# Altium schematic sheet MCU(ZC-ST4X-A005A)(1).SchDoc
size A1
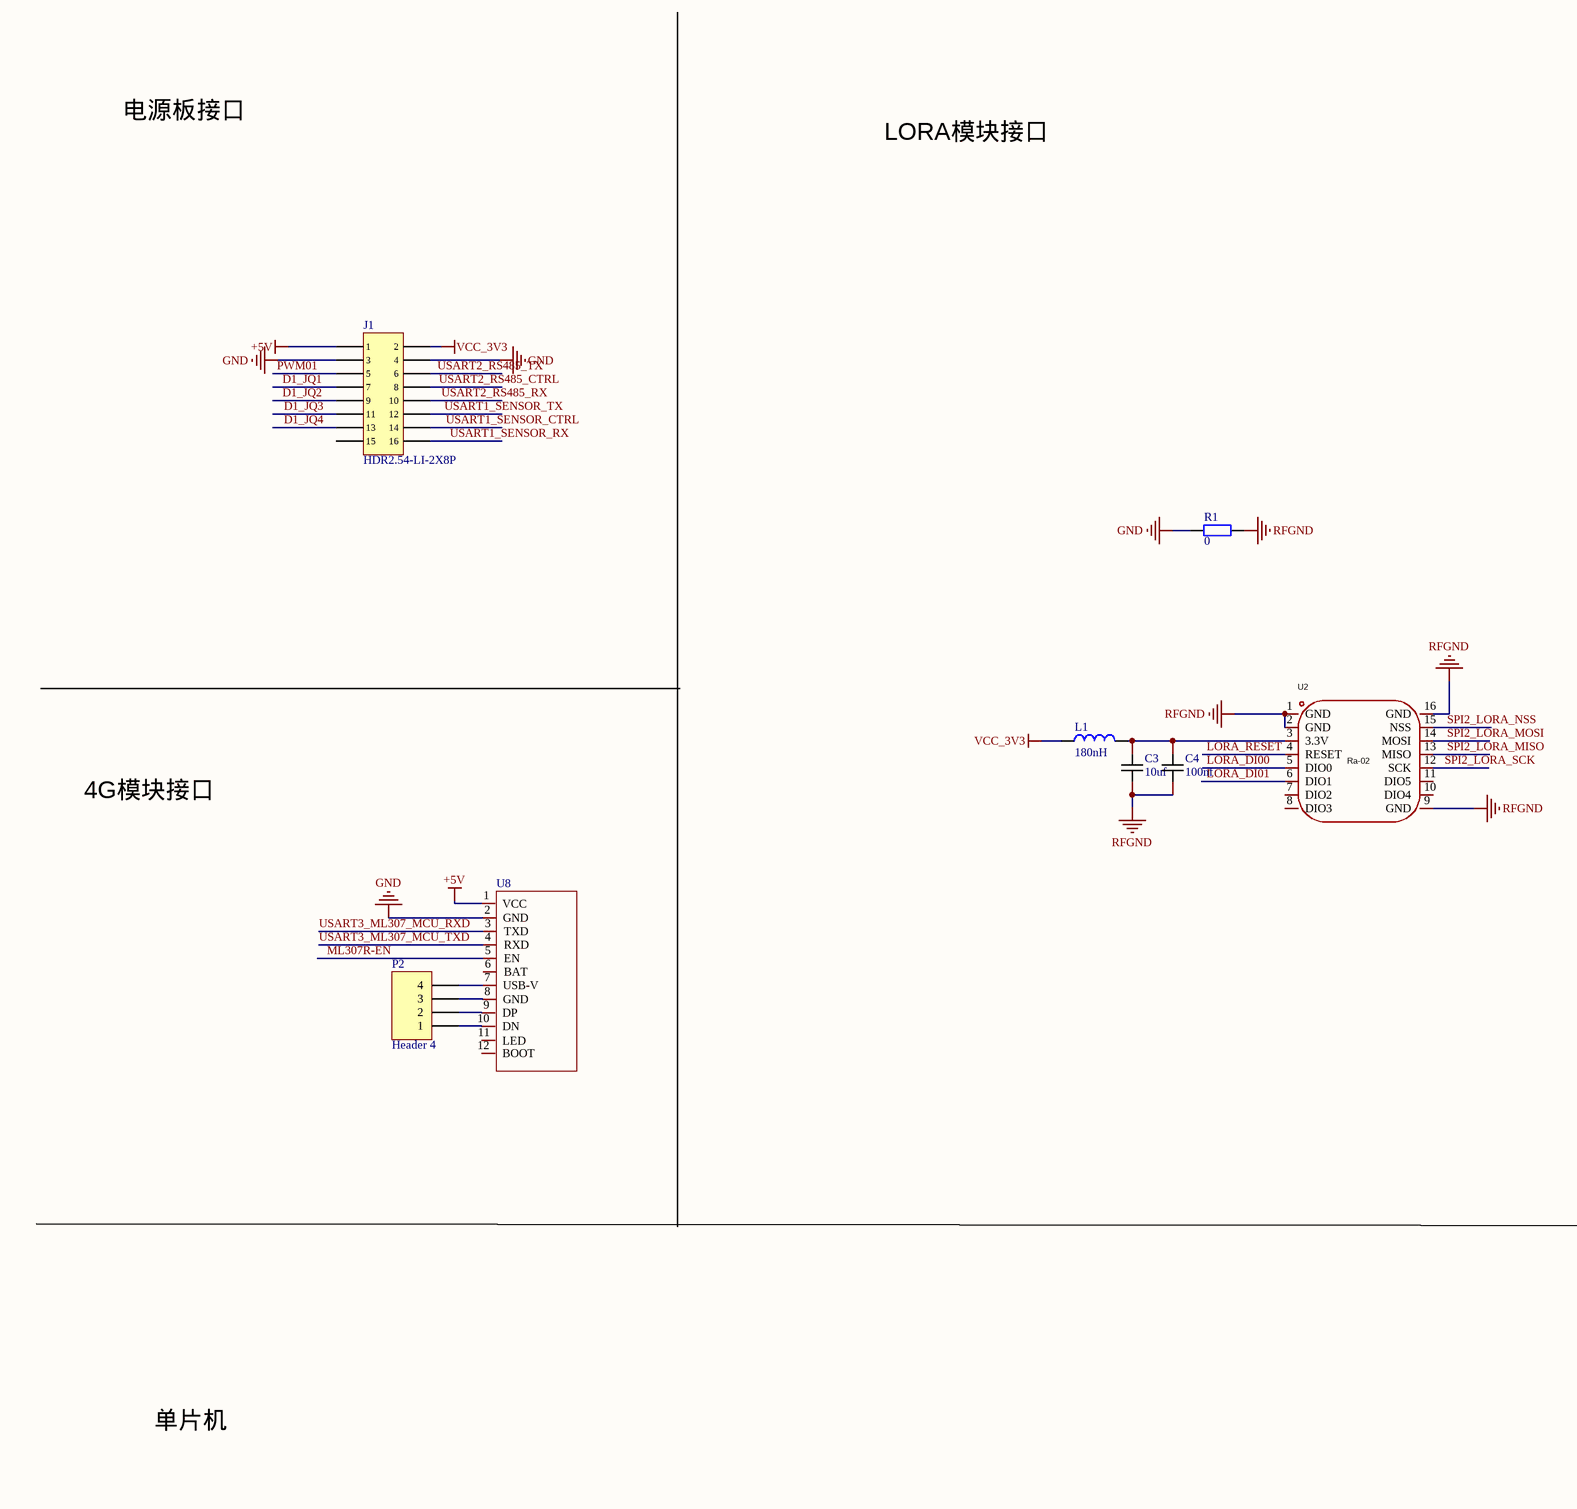
[diagram p0: MCU(ZC-ST4X-A005A)(1).SchDoc, top left]
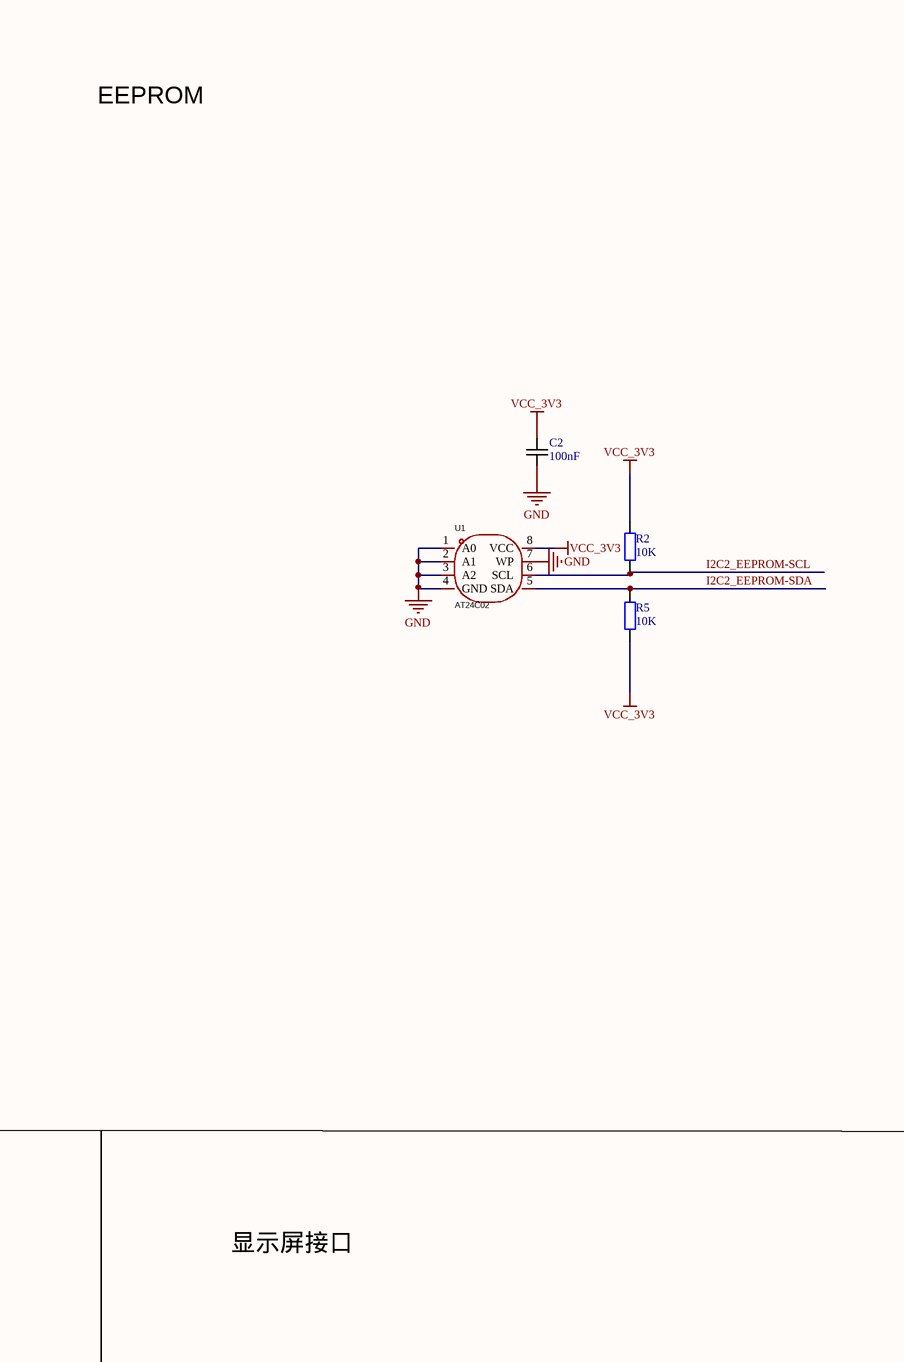
[diagram p1: MCU(ZC-ST4X-A005A)(1).SchDoc, top middle]
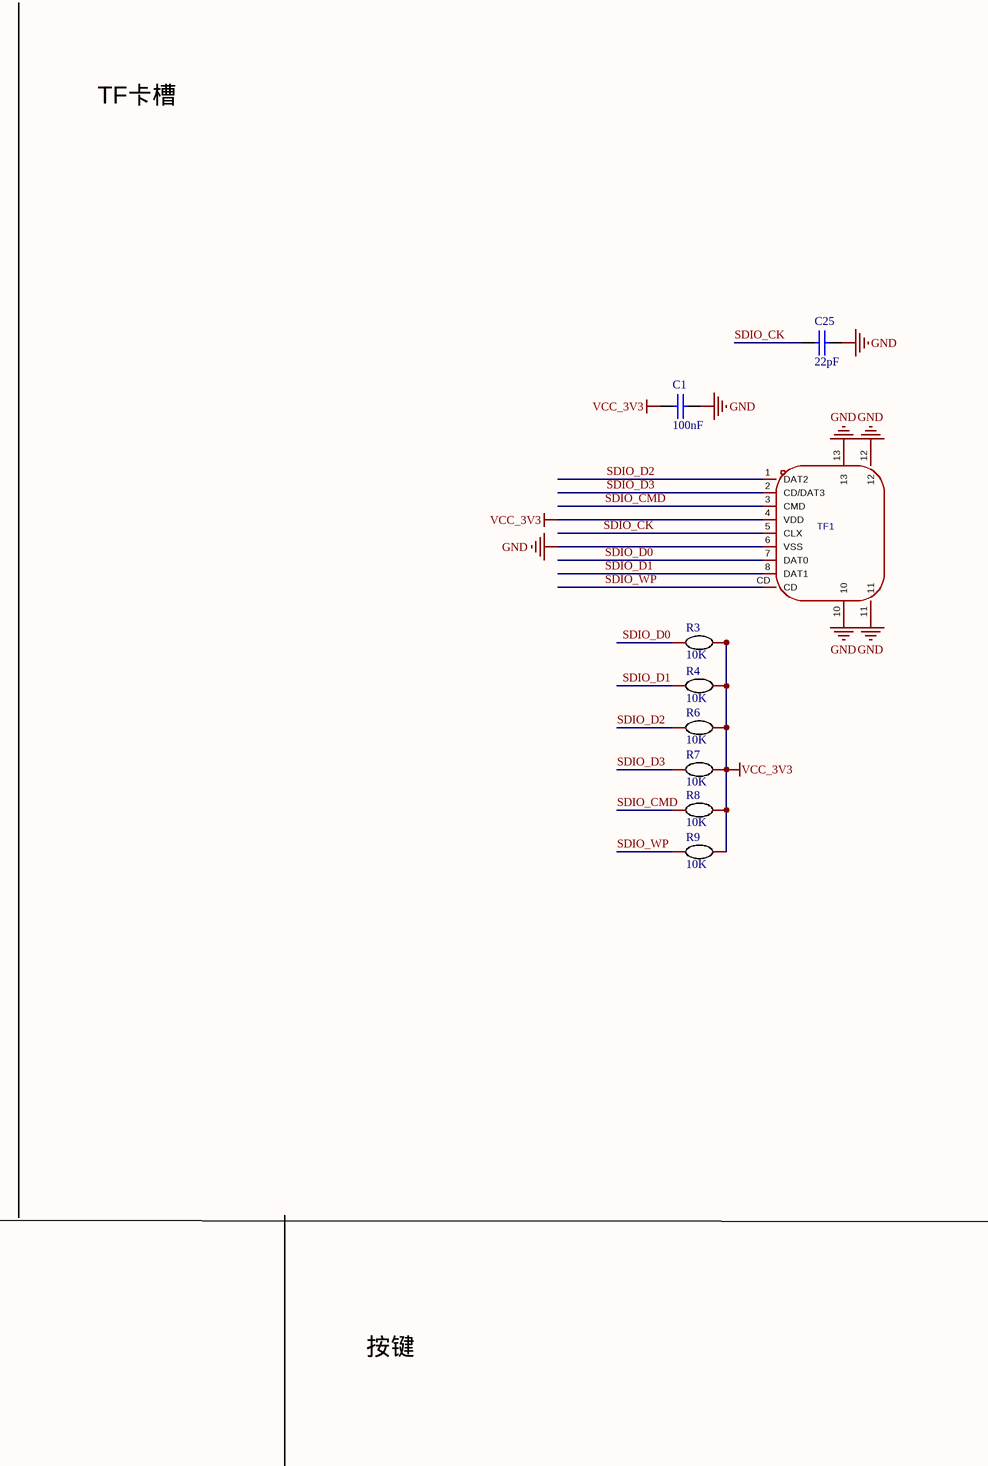
[diagram p2: MCU(ZC-ST4X-A005A)(1).SchDoc, top right]
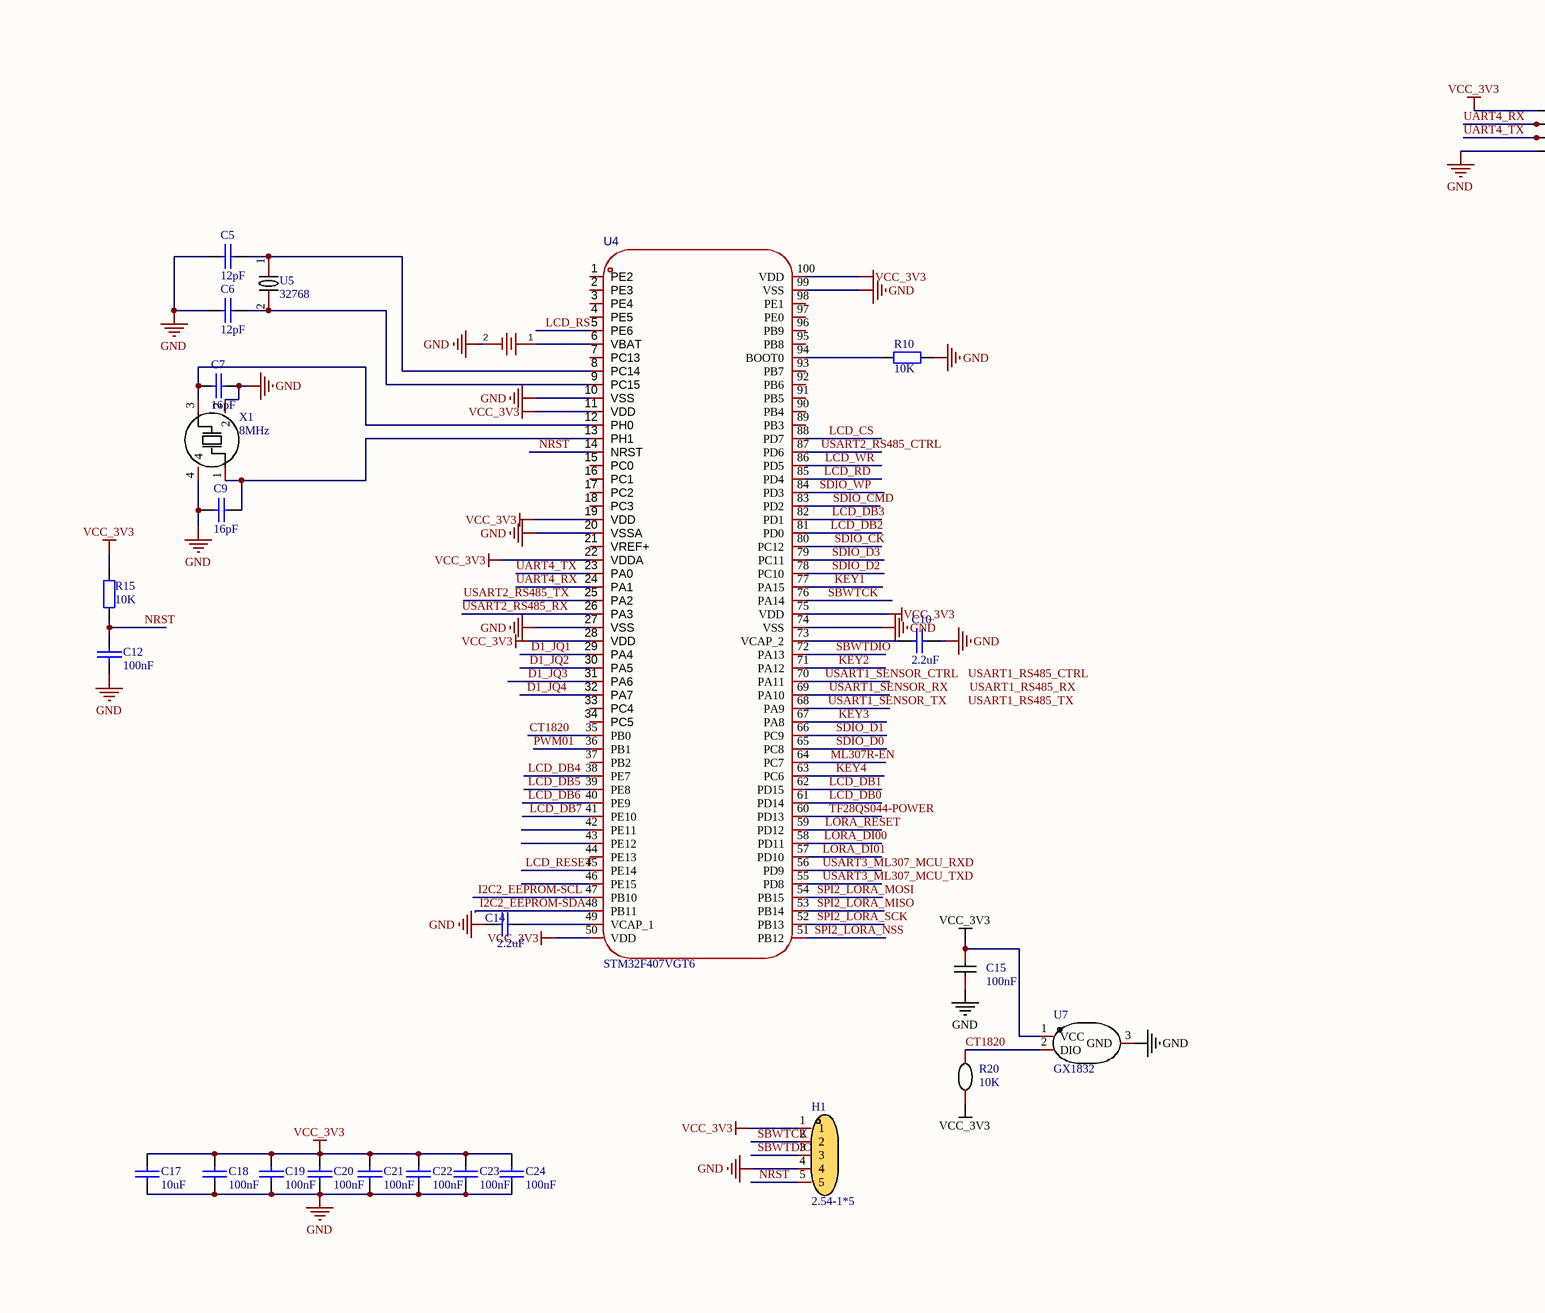
[diagram p3: MCU(ZC-ST4X-A005A)(1).SchDoc, bottom left]
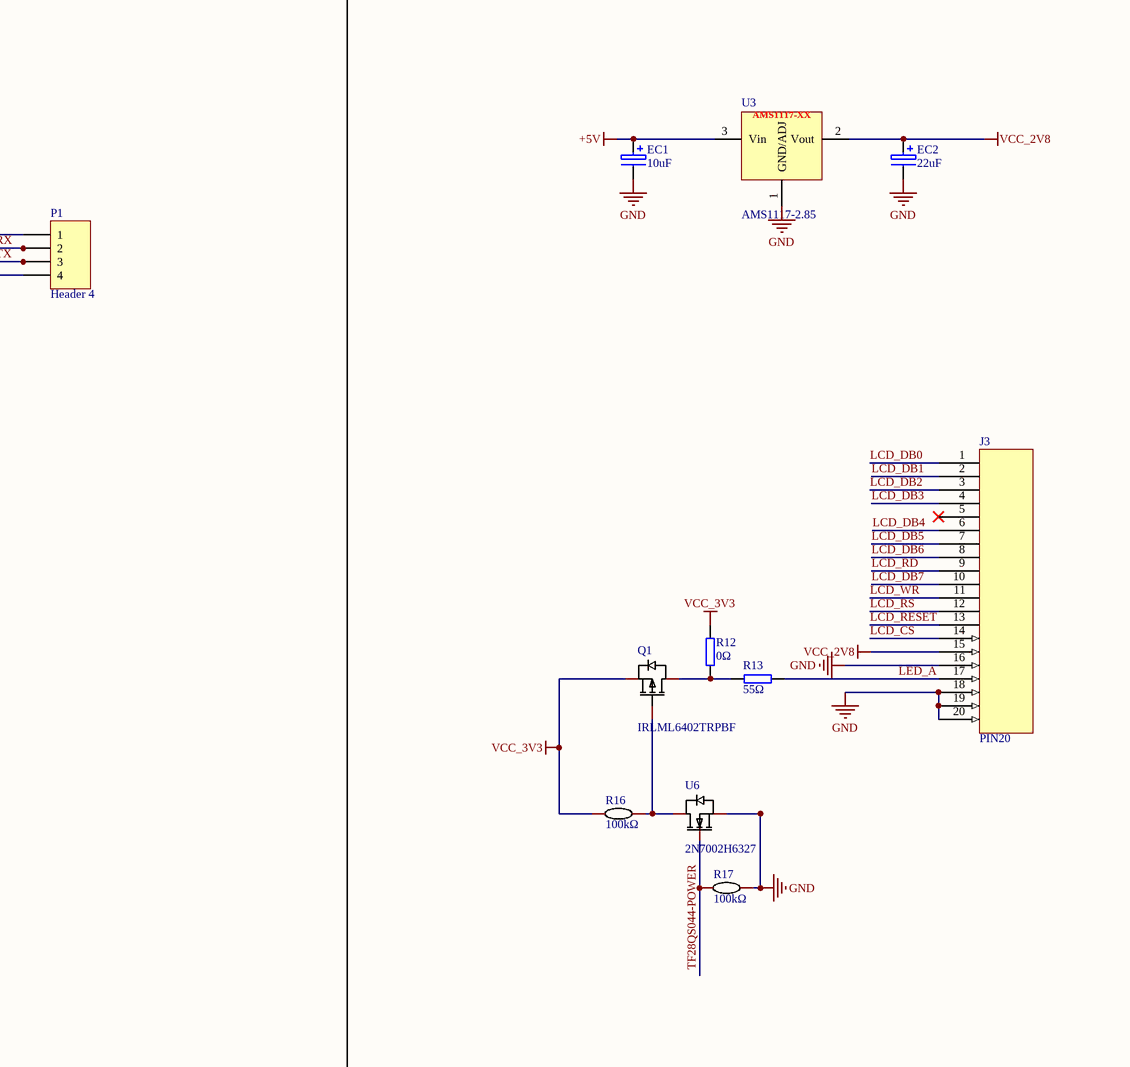
[diagram p4: MCU(ZC-ST4X-A005A)(1).SchDoc, bottom middle]
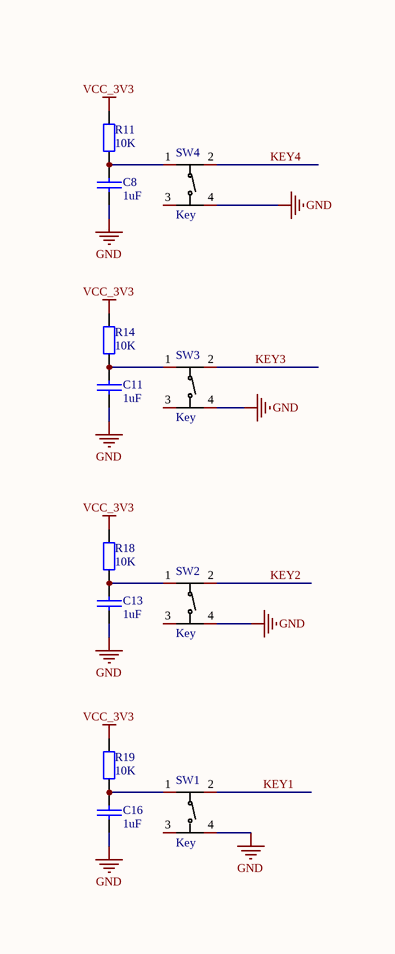
[diagram p5: MCU(ZC-ST4X-A005A)(1).SchDoc, bottom right]

## Parts
BAT1  KH-CR2032-2-1  [BAT-TH_CR2032-BS-6-1]  (value not drawn)
C1  100nF  [C-0603]
C2  100nF  [C-0603]
C3  10uf  [C-0603]
C4  100nf  [C-0603]
C5  12pF  [C-0603]
C6  12pF  [C-0603]
C7  16pF  [C-0603]
C8  1uF  [C-0805]
C9  16pF  [C-0603]
C10  2.2uF  [C-0603]
C11  1uF  [C-0805]
C12  100nF  [C-0603]
C13  1uF  [C-0805]
C14  2.2uF  [C-0603]
C15  100nF  [C-0603]
C16  1uF  [C-0805]
C17  10uF  [C-0603]
C18  100nF  [C-0603]
C19  100nF  [C-0603]
C20  100nF  [C-0603]
C21  100nF  [C-0603]
C22  100nF  [C-0603]
C23  100nF  [C-0603]
C24  100nF  [C-0603]
C25  22pF  [C-0603]
EC1  10uF  [C4*H]
EC2  22uF  [C4*H]
H1  2.54-1*5  [HDR-TH_5P-P2.54-V-M]
J1  HDR2.54-LI-2X8P  [IDC-TH_16P-P2.54_BOOMELE-2X8P]
J3  PIN20  [FPC-SMD_KH-CL0.5-H2.0-18PS]
L1  180nH  [R-0805]
P1  Header 4  [HDR2.54-M-LI-4P]
P2  Header 4  [HDR2.54-M-LI-4P]
Q1  IRLML6402TRPBF  [SOT-23-3_L2.9-W1.6-P1.90-LS2.8-BR]
R1  0  [R-0805]
R2  10K  [R-0603]
R3  Name: 10K  [R-0603]  (hidden comment: TPM2S103P110R)
R4  Name: 10K  [R-0603]  (hidden comment: TPM2S103P110R)
R5  10K  [R-0603]
R6  Name: 10K  [R-0603]  (hidden comment: TPM2S103P110R)
R7  Name: 10K  [R-0603]  (hidden comment: TPM2S103P110R)
R8  Name: 10K  [R-0603]  (hidden comment: TPM2S103P110R)
R9  Name: 10K  [R-0603]  (hidden comment: TPM2S103P110R)
R10  10K  [R-0603]
R11  10K  [R-0805]
R12  0Ω  [R-0805]
R13  55Ω  [R-0805]
R14  10K  [R-0805]
R15  10K  [C-0603]
R16  100kΩ  [r0805]
R17  100kΩ  [r0805]
R18  10K  [R-0805]
R19  10K  [R-0805]
R20  Name: 10K  [R-0603]  (hidden comment: TPM2S103P110R)
SW1  Key  [12X12轻触按键]
SW2  Key  [12X12轻触按键]
SW3  Key  [12X12轻触按键]
SW4  Key  [12X12轻触按键]
TF1  TF-012  [TF-SMD_TF-012]  (value not drawn)
U1  AT24C02  [SOIC-8]
U2  Ra-02  [WIRELM-SMD_RA-02-BL]
U3  AMS1117-2.85  [SOT-223-4]
U4  STM32F407VGT6  [LQFP-100_L14.0-W14.0-P0.50-LS16.0-BL]
U5  32768  [CRYSTAL-SMD_L3.2-W1.5]
U6  2N7002H6327  [PG-SOT23-3_L2.9-W1.3-P1.90-LS2.4-BR]
U7  Name: GX1832  [SOT-23-3]  (hidden comment: CT1720KR)
U8  U8  [4G]  (value not drawn)
X1  8MHz  [CRYSTAL-SMD_4P-L3.2-W2.5-BL]

## Nets
+5V: EC1.1 J1.1 U3.3(Vin) U8.1(VCC)
GND: BAT1.2 C1.1 C2.1 C5.1 C6.1 C7.1 C8.1 C9.2 C10.1 C11.1 C12.1 C13.1 C14.1 C15.1 C16.1 C17.1 C18.1 C19.1 C20.1 C21.1 C22.1 C23.1 C24.1 C25.2 EC1.2 EC2.2 H1.4 J1.3 J1.4 J3.16 J3.18 J3.19 J3.20 P1.4 R1.1 R10.1 R17.1 SW1.4 SW2.4 SW3.4 SW4.4 TF1.6(VSS) TF1.10 TF1.11 TF1.12 TF1.13 U1.1(A0) U1.2(A1) U1.3(A2) U1.4(GND) U1.7(WP) U3.1(GND/ADJ) U4.10(VSS) U4.20(VSSA) U4.27(VSS) U4.74(VSS) U4.99(VSS) U6.2(S) U7.3(GND) U8.2(GND) X1.2 X1.4
RFGND: C3.1 C4.1 R1.2 U2.1(GND) U2.2(GND) U2.9(GND) U2.16(GND)
VCC_2V8: EC2.1 J3.15 U3.2(Vout)
VCC_3V3: C1.2 C2.2 C15.2 C17.2 C18.2 C19.2 C20.2 C21.2 C22.2 C23.2 C24.2 H1.1 J1.2 L1.1 P1.1 Q1.2(S) R2.2 R3.2 R4.2 R5.1 R6.2 R7.2 R8.2 R9.2 R11.2 R12.1 R14.2 R15.2 R16.2 R18.2 R19.2 R20.1 TF1.4(VDD) U1.8(VCC) U4.11(VDD) U4.19(VDD) U4.22(VDDA) U4.28(VDD) U4.50(VDD) U4.75(VDD) U4.100(VDD) U7.1(VCC)
CT1820: R20.2 U4.35(PB0) U7.2(DIO)
D1_JQ1: J1.7 U4.29(PA4)
D1_JQ2: J1.9 U4.30(PA5)
D1_JQ3: J1.11 U4.31(PA6)
D1_JQ4: J1.13 U4.32(PA7)
I2C2_EEPROM-SCL: R2.1 U1.6(SCL) U4.47(PB10)
I2C2_EEPROM-SDA: R5.2 U1.5(SDA) U4.48(PB11)
KEY1: SW1.2 U4.77(PA15)
KEY2: SW2.2 U4.71(PA12)
KEY3: SW3.2 U4.67(PA8)
KEY4: SW4.2 U4.63(PC6)
LCD_CS: J3.14 U4.88(PD7)
LCD_DB0: J3.1 U4.61(PD14)
LCD_DB1: J3.2 U4.62(PD15)
LCD_DB2: J3.3 U4.81(PD0)
LCD_DB3: J3.4 U4.82(PD1)
LCD_DB4: J3.6 U4.38(PE7)
LCD_DB5: J3.7 U4.39(PE8)
LCD_DB6: J3.8 U4.40(PE9)
LCD_DB7: J3.10 U4.41(PE10)
LCD_RD: J3.9 U4.85(PD4)
LCD_RESET: J3.13 U4.45(PE14)
LCD_RS: J3.12 U4.5(PE6)
LCD_WR: J3.11 U4.86(PD5)
LED_A: J3.17 R13.1
LORA_DI00: U2.5(DIO0) U4.58(PD11)
LORA_DI01: U2.6(DIO1) U4.57(PD10)
LORA_RESET: U2.4(RESET) U4.59(PD12)
ML307R-EN: U4.64(PC7) U8.5(EN)
NRST: C12.2 H1.5 R15.1 U4.14(NRST)
PWM01: J1.5 U4.36(PB1)
SBWTCK: H1.2 U4.76(PA14)
SBWTDIO: H1.3 U4.72(PA13)
SDIO_CK: C25.1 TF1.5(CLX) U4.80(PC12)
SDIO_CMD: R8.1 TF1.3(CMD) U4.83(PD2)
SDIO_D0: R3.1 TF1.7(DAT0) U4.65(PC8)
SDIO_D1: R4.1 TF1.8(DAT1) U4.66(PC9)
SDIO_D2: R6.1 TF1.1(DAT2) U4.78(PC10)
SDIO_D3: R7.1 TF1.2(CD/DAT3) U4.79(PC11)
SDIO_WP: R9.1 TF1.CD U4.84(PD3)
SPI2_LORA_MISO: U2.13(MISO) U4.53(PB14)
SPI2_LORA_MOSI: U2.14(MOSI) U4.54(PB15)
SPI2_LORA_NSS: U2.15(NSS) U4.51(PB12)
SPI2_LORA_SCK: U2.12(SCK) U4.52(PB13)
TF28QS044-POWER: R17.2 U4.60(PD13) U6.1(G)
UART4_RX: P1.2 U4.24(PA1)
UART4_TX: P1.3 U4.23(PA0)
USART1_SENSOR_CTRL: J1.14 U4.70(PA11)
USART1_SENSOR_RX: J1.16 U4.69(PA10)
USART1_SENSOR_TX: J1.12 U4.68(PA9)
USART2_RS485_CTRL: J1.8 U4.87(PD6)
USART2_RS485_RX: J1.10 U4.26(PA3)
USART2_RS485_TX: J1.6 U4.25(PA2)
USART3_ML307_MCU_RXD: U4.56(PD9) U8.3(TXD)
USART3_ML307_MCU_TXD: U4.55(PD8) U8.4(RXD)
NetBAT1_1: BAT1.1 U4.6(VBAT)
NetC3_2: C3.2 C4.2 L1.2 U2.3(3.3V)
NetC5_2: C5.2 U4.8(PC14) U5.1
NetC6_2: C6.2 U4.9(PC15) U5.2
NetC7_2: C7.2 U4.12(PH0) X1.3(OSC2)
NetC8_2: C8.2 R11.1 SW4.1
NetC9_1: C9.1 U4.13(PH1) X1.1(OSC1)
NetC10_2: C10.2 U4.73(VCAP_2)
NetC11_2: C11.2 R14.1 SW3.1
NetC13_2: C13.2 R18.1 SW2.1
NetC14_2: C14.2 U4.49(VCAP_1)
NetC16_2: C16.2 R19.1 SW1.1
NetP2_1: P2.1 U8.10(DN)
NetP2_2: P2.2 U8.9(DP)
NetP2_3: P2.3 U8.8(GND)
NetP2_4: P2.4 U8.7(USB-V)
NetQ1_1: Q1.1(G) R16.1 U6.3(D)
NetQ1_3: Q1.3(D) R12.2 R13.2
NetR10_2: R10.2 U4.94(BOOT0)

Not connected (* = marked no-connect by the designer): J1 15; J3 5*; SW1 3; SW2 3; SW3 3; SW4 3; U2 7(DIO2) 8(DIO3) 10(DIO4) 11(DIO5); U4 1(PE2) 2(PE3) 3(PE4) 4(PE5) 7(PC13) 15(PC0) 16(PC1) 17(PC2) 18(PC3) 21(VREF+) 33(PC4) 34(PC5) 37(PB2) 42(PE11) 43(PE12) 44(PE13) 46(PE15) 89(PB3) 90(PB4) 91(PB5) 92(PB6) 93(PB7) 95(PB8) 96(PB9) 97(PE0) 98(PE1); U8 6(BAT) 11(LED) 12(BOOT)

## Notes on the sheet
- 电源板接口
- LORA模块接口
- TF卡槽
- EEPROM
- 4G模块接口
- 显示屏接口
- 按键
- 单片机
- Labels drawn without touching a wire or pin: USART1_RS485_CTRL, USART1_RS485_RX, USART1_RS485_TX

## Library data of the parts
C1 C5-C14 C16-C25 = C普通电容: 电容
C2 C4 = 0805B104K500NT: Manufacturer: FH(风华); Symbol: CAPC1220X70N; Add into BOM: yes; Tolerance: ±10%; Voltage Rated: 50V; Temperature Coefficient: X7R; Name: 100nF; Device: 0805B104K500NT; LCSC Part Name: 100nF±10%50V; Supplier Part: C38141; Manufacturer Part: 0805B104K500NT; Supplier Footprint: 0805; JLCPCB Part Class: ExtendedPart; Datasheet: https://atta.szlcsc.com/upload/public/pdf/source/20170923/C38141_1506149447419988747.pdf; Supplier: LCSC; Convert to PCB: yes; Value: 100nF
C3 = 0805B104K500NT: Manufacturer: FH(风华); Name: 100nF; Symbol: CAPC1220X70N; Add into BOM: yes; Value: 100nF; Tolerance: ±10%; Voltage Rated: 50V; Temperature Coefficient: X7R; Device: 0805B104K500NT; LCSC Part Name: 100nF±10%50V; Supplier Part: C38141; Manufacturer Part: 0805B104K500NT; Supplier Footprint: 0805; JLCPCB Part Class: ExtendedPart; Datasheet: https://atta.szlcsc.com/upload/public/pdf/source/20170923/C38141_1506149447419988747.pdf; Supplier: LCSC; Convert to PCB: yes
C15 = 0805B104K500NT: Manufacturer: FH(风华); Symbol: CL10A105KB8NNNC; Add into BOM: yes; Tolerance: ±10%; Voltage Rated: 50V; Temperature Coefficient: X7R; Name: 100nF; Device: 0805B104K500NT; LCSC Part Name: 100nF±10%50V; Supplier Part: C38141; Manufacturer Part: 0805B104K500NT; Supplier Footprint: 0805; JLCPCB Part Class: ExtendedPart; Datasheet: https://atta.szlcsc.com/upload/public/pdf/source/20170923/C38141_1506149447419988747.pdf; Supplier: LCSC; Convert to PCB: yes; Value: 100nF
EC1 EC2 = CAP-EC
J1 = HDR2.54-LI-2X8P: 直插立式双排针
L1 = 0603' 180nH 2% 0.24A 车规: 贴片电感; 品牌: 村田; 厂商型号: LQW18ASR18G0ZD; 华芯物料编号: HXE0300100002
P1 P2 = Header 4: Header, 4-Pin; LatestRevisionDate: 17-Jul-2002; LatestRevisionNote: Re-released for DXP Platform.; Publisher: Altium Limited
Q1 = IRLML6402TRPBF_C2593: Manufacturer: Infineon(英飞凌); Add into BOM: yes; Type: P沟道; Drain Source Voltage (Vdss): 20V; Continuous Drain Current (Id): 3.7A; Power Dissipation (Pd): 1.3W; Drain Source On Resistance (RDS(on)@Vgs,Id): 65mΩ@4.5V,3.7A; Gate Threshold Voltage (Vgs(th)@Id): 1.2V@250uA; Name: IRLML6402TRPBF; Symbol: IRLML6402TRPBF; Device: IRLML6402TRPBF_C2593; LCSC Part Name: P沟道20V3.7A; Supplier Part: C2593; Manufacturer Part: IRLML6402TRPBF; Supplier Footprint: SOT-23-3L; JLCPCB Part Class: ExtendedPart; Datasheet: https://atta.szlcsc.com/upload/public/pdf/source/20140818/1457707226203.pdf; Supplier: LCSC; Convert to PCB: yes
R1 R2 R5 = 通用电阻: 贴片电阻，未编号，未录入华芯元件库，临时封装，包括0201，0402，0603，0805，1206，1210，1812，2010，2512
R3 R4 R6-R9 R20 = TPM2S103P110R: Add into BOM: yes; Symbol: TPM2S103P110R; Device: TPM2S103P110R; LCSC Part Name: TPM2S103P110R; Supplier Part: C9900018477; Manufacturer Part: TPM2S103P110R; Supplier Footprint: 10K-B3950-0805; JLCPCB Part Class: ExtendedPart; Datasheet: https://atta.szlcsc.comnull; Supplier: LCSC; Convert to PCB: yes
R10 R11 R14 R15 R18 R19 = RES: 电阻; Value: 5.1K; Published: 8-Jun-2000; LatestRevisionDate: 17-Jul-2002; LatestRevisionNote: Re-released for DXP Platform.; PackageReference: AXIAL-0.4; Publisher: Altium Limited
R12 R13 = RES-SMD: 0603
R16 R17 = 0805W8F1002T5E_C17414: 电阻类型:厚膜电阻;阻值:10kΩ;精度:±1%;功率:125mW;温度系数:±100ppm/℃;最大工作电压:150V;工作温度范围:-55℃~+155℃;; Manufacturer: UNI-ROYAL(厚声); Add into BOM: yes; Tolerance: ±1%; Power(Watts): 125mW; Overload Voltage (Max): 150V; Name: 100kΩ; Symbol: 0805W8F1002T5E; Device: 0805W8F1002T5E_C17414; LCSC Part Name: 10kΩ±1%125mW; Supplier Part: C17414; Manufacturer Part: 0805W8F1002T5E; Supplier Footprint: 0805; JLCPCB Part Class: BasicPart; Datasheet: https://atta.szlcsc.com/upload/public/pdf/source/20200306/C422600_1E6D84923E4A46A82E41ADD87F860B5C.pdf; Supplier: LCSC; Convert to PCB: yes; Type: 厚膜电阻; Value: 100kΩ; Temperature Coefficient: ±100ppm/℃; Operating Temperature Range: -55℃~+155℃
U1 = AT24C02_C688857: Manufacturer: IDCHIP(英锐芯); Add into BOM: yes; Symbol: AT24C02; Device: AT24C02_C688857; LCSC Part Name: AT24C02; Supplier Part: C688857; Manufacturer Part: AT24C02; Supplier Footprint: SOP-8; JLCPCB Part Class: Extended Part; Datasheet: https://atta.szlcsc.com/upload/public/pdf/source/20200619/C688857_168265888F77B455D6D4136881F4BB15.pdf; Supplier: LCSC; Convert to PCB: yes
U2 = Ra-02_C90039: Manufacturer: Ai-Thinker(安信可); Add into BOM: yes; Output Power: 20dBm; Support Interface: SPI; Modulation System: LoRa；OOK；MSK；GFSK；FSK；GMSK; Operating Voltage: 3.3V; Antenna Type: IPEX接口; Receive  Current: 12.15mA; Send  Current: 105mA; Sensitivity: -140dBm; Symbol: RA-02; Device: Ra-02_C90039; LCSC Part Name: 433MHz LORA扩频无线模块 超远10KM SX1278; Supplier Part: C90039; Manufacturer Part: Ra-02; Supplier Footprint: SMD-16P; JLCPCB Part Class: Extended Part; Datasheet: https://atta.szlcsc.com/upload/public/pdf/source/20181018/C90039_B5D7ADB38ADA1100C85850A55553934D.pdf; Supplier: LCSC; Convert to PCB: yes; Operating Temperature: -40℃~+85℃
U3 = AMS1117-XX: AMS   800mA LOW DROPOUT VOLTAGE REGULATOR
U4 = STM32F407VGT6: Symbol: STM32C031K6T6
U5 = 7N032768NW2
U6 = 2N7002 H6327: Manufacturer: Infineon(英飞凌); Add into BOM: yes; Name: 2N7002H6327; Symbol: 2N7002 H6327; Device: 2N7002 H6327; LCSC Part Name: 2N7002H6327; Supplier Part: C533095; Manufacturer Part: 2N7002H6327; Supplier Footprint: PG-SOT-23-3; JLCPCB Part Class: ExtendedPart; Datasheet: https://atta.szlcsc.com/upload/public/pdf/source/20220830/BD30B6441EBE5CA0CCBEB0FC11431461.pdf; Supplier: LCSC; Convert to PCB: yes
U7 = CT1720KR: Manufacturer: SENSYLINK(申矽凌); Add into BOM: yes; Symbol: CT1720KR; Device: CT1720KR; LCSC Part Name: CT1720KR; Supplier Part: C5121996; Manufacturer Part: CT1720KR; Supplier Footprint: SOT-23; JLCPCB Part Class: ExtendedPart; Datasheet: https://atta.szlcsc.com/upload/public/pdf/source/20220810/E991F5BA30E48E4A6D2AB5BBD05BFFEE.pdf; Supplier: LCSC; Convert to PCB: yes
U8 = 4G(ML307R)
X1 = 无源晶振
BAT1 = KH-CR2032-2-1: Symbol: KH-CR2032-2-1
TF1 = TF-012: Symbol: TF-012